# EAGLE design untitled (EAGLE 7.3.0)
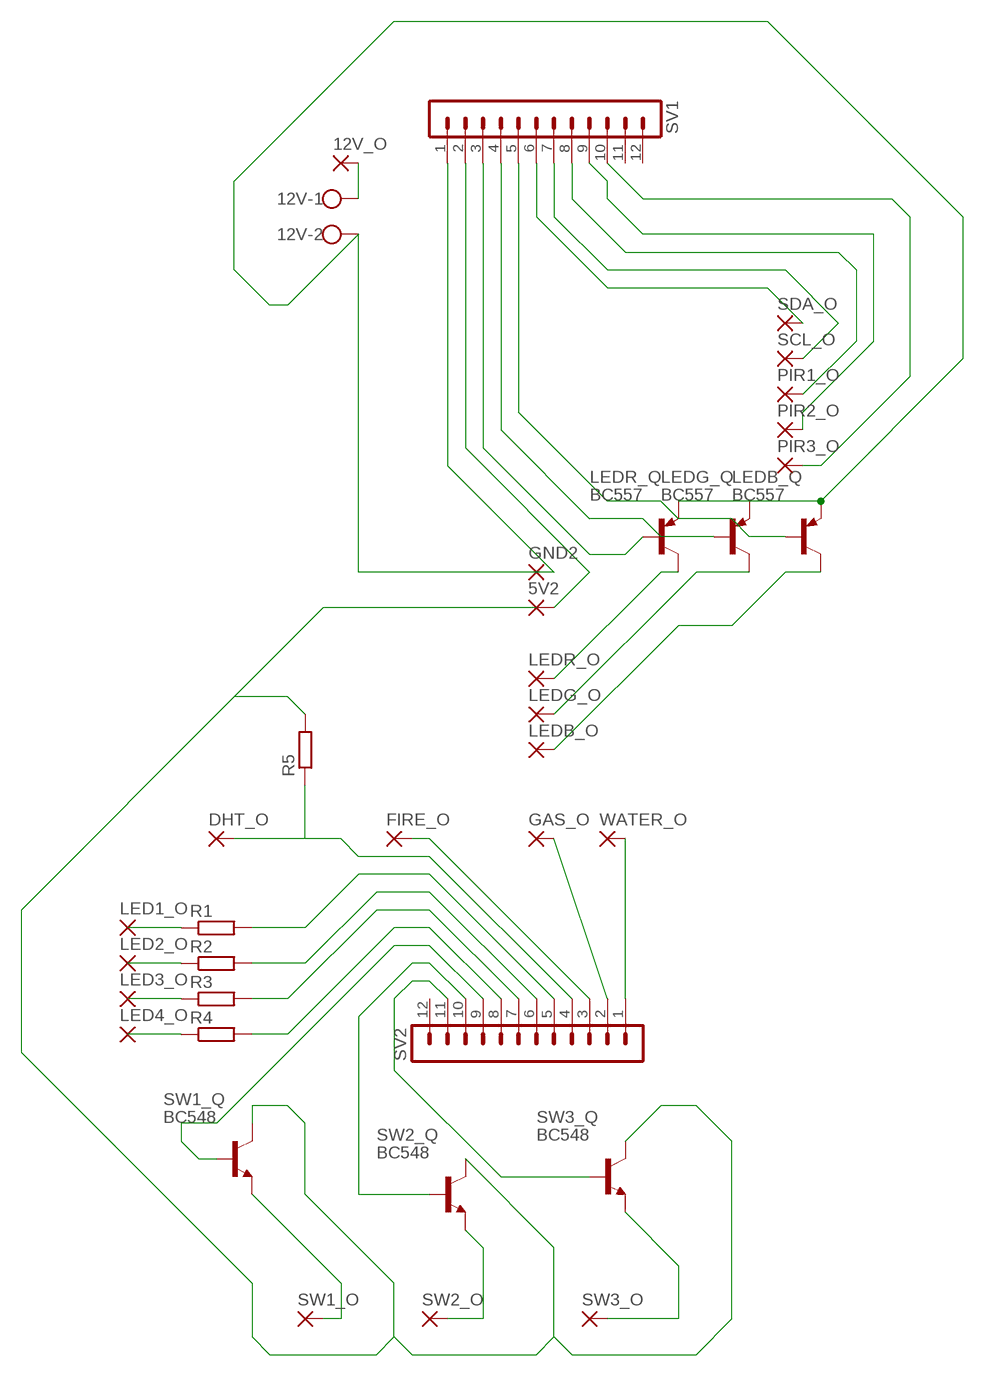
[diagram p0: schematic, sheet 1]

## Parts
5V2  1,6/0,8  [1,6/0,8]
12V  W237-102  [W237-102]
12V_O  1,6/0,8  [1,6/0,8]
DHT_O  1,6/0,8  [1,6/0,8]
FIRE_O  1,6/0,8  [1,6/0,8]
GAS_O  1,6/0,8  [1,6/0,8]
GND2  1,6/0,8  [1,6/0,8]
LED1_O  1,6/0,8  [1,6/0,8]
LED2_O  1,6/0,8  [1,6/0,8]
LED3_O  1,6/0,8  [1,6/0,8]
LED4_O  1,6/0,8  [1,6/0,8]
LEDB_O  1,6/0,8  [1,6/0,8]
LEDB_Q  BC557  [TO92-EBC]
LEDG_O  1,6/0,8  [1,6/0,8]
LEDG_Q  BC557  [TO92-EBC]
LEDR_O  1,6/0,8  [1,6/0,8]
LEDR_Q  BC557  [TO92-EBC]
PIR1_O  1,6/0,8  [1,6/0,8]
PIR2_O  1,6/0,8  [1,6/0,8]
PIR3_O  1,6/0,8  [1,6/0,8]
R1  R-EU_0207/15  [0207/15]
R2  R-EU_0207/15  [0207/15]
R3  R-EU_0207/15  [0207/15]
R4  R-EU_0207/15  [0207/15]
R5  R-EU_0207/15  [0207/15]
SCL_O  1,6/0,8  [1,6/0,8]
SDA_O  1,6/0,8  [1,6/0,8]
SV1  MA12-1W  [MA12-1W]
SV2  MA12-1W  [MA12-1W]
SW1_O  1,6/0,8  [1,6/0,8]
SW1_Q  BC548  [TO92-EBC]
SW2_O  1,6/0,8  [1,6/0,8]
SW2_Q  BC548  [TO92-EBC]
SW3_O  1,6/0,8  [1,6/0,8]
SW3_Q  BC548  [TO92-EBC]
WATER_O  1,6/0,8  [1,6/0,8]

## Nets
N$1: 12V.2 GND2.1(P) LEDB_Q.E LEDG_Q.E LEDR_Q.E SV1.1
N$2: 5V2.1(P) SV1.2
N$3: LEDR_Q.B SV1.3
N$4: LEDG_Q.B SV1.4
N$5: LEDB_Q.B SV1.5
N$6: SDA_O.1(P) SV1.6
N$7: SCL_O.1(P) SV1.7
N$8: PIR1_O.1(P) SV1.8
N$9: PIR2_O.1(P) SV1.9
N$10: PIR3_O.1(P) SV1.10
N$11: SV2.1 WATER_O.1(P)
N$12: GAS_O.1(P) SV2.2
N$13: FIRE_O.1(P) SV2.3
N$14: DHT_O.1(P) R5.1 SV2.4
N$15: SV2.11 SW3_Q.B
N$16: SV2.10 SW2_Q.B
N$17: SV2.9 SW1_Q.B
N$18: R4.2 SV2.8
N$19: R3.2 SV2.7
N$20: R2.2 SV2.6
N$21: R1.2 SV2.5
N$22: LED4_O.1(P) R4.1
N$23: LED3_O.1(P) R3.1
N$24: LED2_O.1(P) R2.1
N$25: LED1_O.1(P) R1.1
N$26: LEDR_O.1(P) LEDR_Q.C
N$27: LEDG_O.1(P) LEDG_Q.C
N$28: R5.2 SW1_Q.C SW2_Q.C SW3_Q.C
N$29: LEDB_O.1(P) LEDB_Q.C
N$30: SW1_O.1(P) SW1_Q.E
N$31: SW2_O.1(P) SW2_Q.E
N$32: SW3_O.1(P) SW3_Q.E
N$33: 12V.1 12V_O.1(P)
Unconnected: SV1.11 SV1.12 SV2.12

## Library data of the parts
5V2 12V_O DHT_O FIRE_O GAS_O GND2 LED1_O LED2_O LED3_O LED4_O LEDB_O LEDG_O LEDR_O PIR1_O PIR2_O PIR3_O SCL_O SDA_O SW1_O SW2_O SW3_O WATER_O = wirepad:1,6/0,8: THROUGH-HOLE PAD
12V = con-wago-500:W237-102: WAGO SCREW CLAMP; MPN: 237-102; OC_FARNELL: unknown; OC_NEWARK: 70K9898
LEDB_Q LEDG_Q LEDR_Q = transistor-pnp:BC557*: PNP Transistror
R1-R5 = resistor:R-EU_: RESISTOR, European symbol
SV1 SV2 = con-lstb:MA12-1W: PIN HEADER; OC_FARNELL: unknown; OC_NEWARK: unknown
SW1_Q SW2_Q SW3_Q = transistor-npn:BC548*: NPN Transistor

## Board
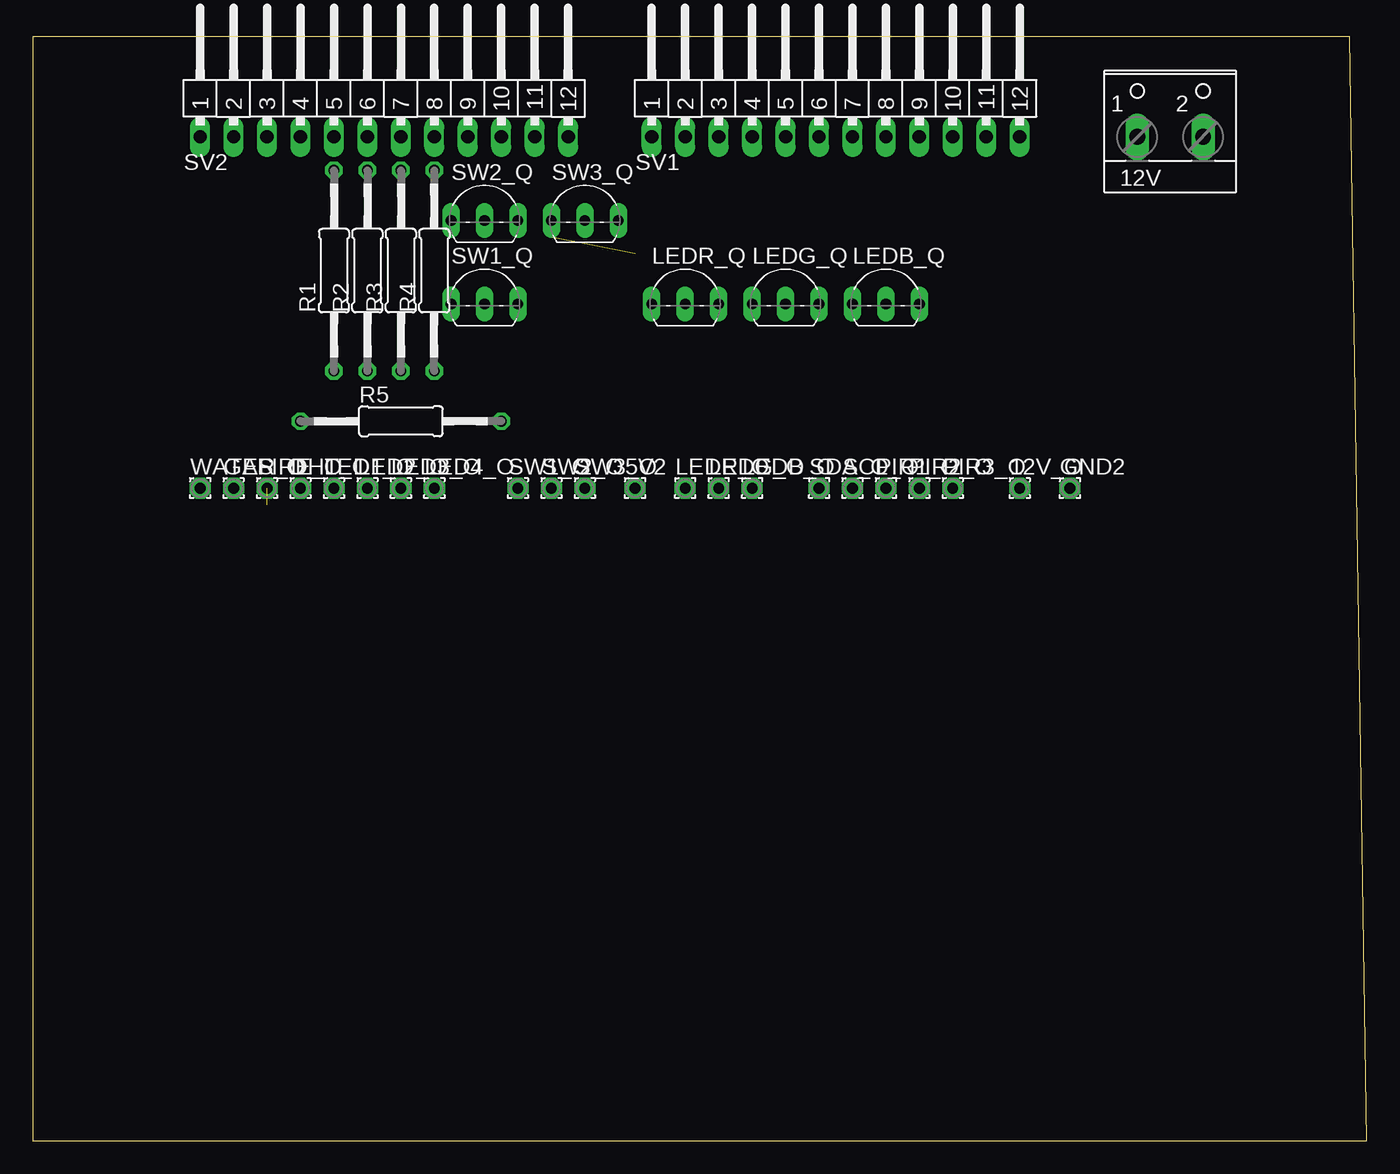
[diagram p1: board, top side]
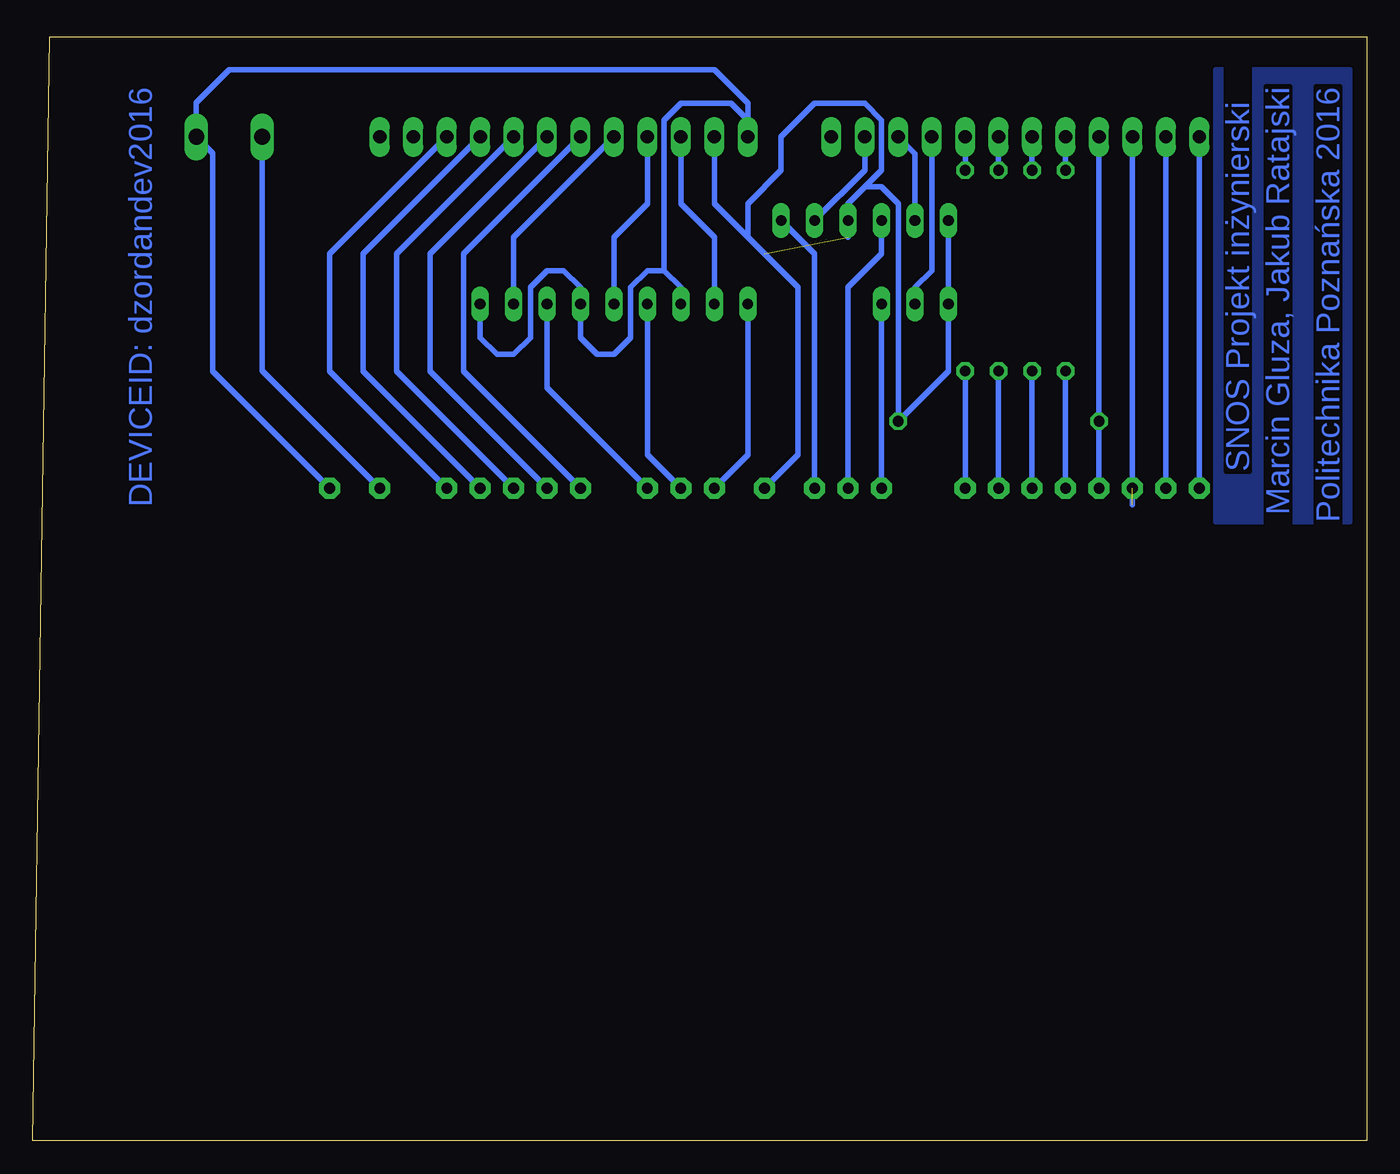
[diagram p2: board, bottom side, seen from below]

Size 101.27 x 83.81 mm. Coordinates in mm from the lower left corner, seen from the top.
Outline: 0,0 101.27,0 100,83.81 0,83.81 0,0
Copper layers (1*16): Top 0.035mm / dielectric 1.5mm / Bottom 0.035mm
Design rules "default": minimum track width 10mil, minimum drill 24mil, track to track 8mil, track to pad 8mil, pad to pad 8mil, via to via 8mil, smd to smd 8mil, copper to edge 40mil, drill to drill 8mil, minimum pad ring 10mil, minimum via ring 8mil, stop-mask expansion 4mil, vias tented up to drill 0mil, thermal gap 10mil

### Footprints (pad centres in the part's own frame; a part is rotated, then mirrored left to right if it is on the bottom)
1,6/0,8 = drill 0.813 pad 1.6 octagon: 1 0,0
W237-102 = drill 1.194 long: 1 -2.5,-1.27; 2 2.5,-1.27
TO92-EBC = drill 0.813 long: B 0,-1.27; C -2.54,-1.27; E 2.54,-1.27
0207/15 = drill 0.813 octagon: 1 -7.62,0; 2 7.62,0
MA12-1W = drill 1.016 long: 1 -13.97,0; 2 -11.43,0; 3 -8.89,0; 4 -6.35,0; 5 -3.81,0; 6 -1.27,0; 7 1.27,0; 8 3.81,0; 9 6.35,0; 10 8.89,0; 11 11.43,0; 12 13.97,0

### Placement (x,y rotation side)
5V2  45.72,49.53 0 top
12V  86.36,77.47 0 top
12V_O  74.93,49.53 0 top
DHT_O  20.32,49.53 0 top
FIRE_O  17.78,49.53 0 top
GAS_O  15.24,49.53 0 top
GND2  78.74,49.53 0 top
LED1_O  22.86,49.53 0 top
LED2_O  25.4,49.53 0 top
LED3_O  27.94,49.53 0 top
LED4_O  30.48,49.53 0 top
LEDB_O  54.61,49.53 0 top
LEDB_Q  64.77,64.77 0 top
LEDG_O  52.07,49.53 0 top
LEDG_Q  57.15,64.77 0 top
LEDR_O  49.53,49.53 0 top
LEDR_Q  49.53,64.77 0 top
PIR1_O  64.77,49.53 0 top
PIR2_O  67.31,49.53 0 top
PIR3_O  69.85,49.53 0 top
R1  22.86,66.04 90 top
R2  25.4,66.04 90 top
R3  27.94,66.04 90 top
R4  30.48,66.04 90 top
R5  27.94,54.61 0 top
SCL_O  62.23,49.53 0 top
SDA_O  59.69,49.53 0 top
SV1  60.96,76.2 0 top
SV2  26.67,76.2 0 top
SW1_O  36.83,49.53 0 top
SW1_Q  34.29,64.77 0 top
SW2_O  39.37,49.53 0 top
SW2_Q  34.29,71.12 0 top
SW3_O  41.91,49.53 0 top
SW3_Q  41.91,71.12 0 top
WATER_O  12.7,49.53 0 top

### Tracks (layer width: path | path; a pad name or v marks a point on that pad's centre or on a via)
N$1
  Bottom 0.406: GND2.1 87.63,58.42 87.63,74.97 12V.2 88.86,78.78 86.36,81.28 49.53,81.28 46.99,78.74 SV1.1 46.99,77.47 48.26,78.74 52.07,78.74 53.34,77.47 53.34,66.04 | LEDB_Q.E 67.31,60.96 66.04,59.69 64.77,59.69 63.5,60.96 63.5,64.77 62.23,66.04 60.96,66.04 59.69,64.77 LEDG_Q.E 59.69,60.96 58.42,59.69 57.15,59.69 55.88,60.96 55.88,64.77 54.61,66.04 53.34,66.04 | 53.34,66.04 52.07,64.77 LEDR_Q.E
N$2
  Bottom 0.406: 5V2.1 43.18,52.07 43.18,64.77 49.53,71.12 SV1.2
N$3
  Bottom 0.406: LEDR_Q.B 49.53,68.58 52.07,71.12 SV1.3
N$4
  Bottom 0.406: LEDG_Q.B 57.15,68.58 54.61,71.12 SV1.4
N$5
  Bottom 0.406: LEDB_Q.B 64.77,68.58 SV1.5
N$6
  Bottom 0.406: SDA_O.1 68.58,58.42 68.58,67.31 SV1.6
N$7
  Bottom 0.406: SV1.7 71.12,67.31 71.12,58.42 SCL_O.1
N$8
  Bottom 0.406: PIR1_O.1 73.66,58.42 73.66,67.31 SV1.8
N$9
  Bottom 0.406: PIR2_O.1 76.2,58.42 76.2,67.31 SV1.9
N$10
  Bottom 0.406: PIR3_O.1 78.74,58.42 78.74,67.31 SV1.10
N$11
  Bottom 0.406: SV2.1 WATER_O.1
N$12
  Bottom 0.406: SV2.2 GAS_O.1
N$13  (1 unrouted)
  Bottom 0.406: SV2.3 17.78,48.26
N$14
  Bottom 0.406: SV2.4 R5.1 DHT_O.1
N$15
  Bottom 0.406: SW3_Q.B 38.1,73.66 SV2.11
N$16
  Bottom 0.406: SV2.10 34.29,74.93 SW2_Q.B
N$17
  Bottom 0.406: SV2.9 33.02,66.04 34.29,64.77 SW1_Q.B
N$18
  Bottom 0.406: SV2.8 R4.2
N$19
  Bottom 0.406: SV2.7 R3.2
N$20
  Bottom 0.406: SV2.6 R2.2
N$21
  Bottom 0.406: SV2.5 R1.2
N$22
  Bottom 0.406: R4.1 LED4_O.1
N$23
  Bottom 0.406: R3.1 LED3_O.1
N$24
  Bottom 0.406: R2.1 LED2_O.1
N$25
  Bottom 0.406: R1.1 LED1_O.1
N$26
  Bottom 0.406: LEDR_O.1 46.99,52.07 LEDR_Q.C
N$27
  Bottom 0.406: LEDG_O.1 54.61,52.07 LEDG_Q.C
N$28  (1 unrouted)
  Bottom 0.406: SW2_Q.C SW1_Q.C 31.75,58.42 R5.2 35.56,71.12 36.83,72.39 38.1,72.39 | 38.1,72.39 39.37,71.12 SW3_Q.C 39.37,68.58 | 38.1,72.39 36.83,73.66 36.83,77.47 38.1,78.74 41.91,78.74 44.45,76.2 44.45,73.66 46.99,71.12 46.99,68.58 45.72,67.31
N$29
  Bottom 0.406: LEDB_O.1 62.23,57.15 LEDB_Q.C
N$30
  Bottom 0.406: SW1_Q.E SW1_O.1
N$31
  Bottom 0.406: SW2_O.1 39.37,64.77 36.83,67.31 SW2_Q.E
N$32
  Bottom 0.406: SW3_Q.E 41.91,67.31 SW3_O.1
N$33
  Bottom 0.406: 12V.1 83.86,58.46 12V_O.1
N$34
  pour Bottom: 1.27,81.28 11.43,81.28 11.43,66.04 11.43,46.99 1.27,46.99

### Text on the board
Bottom: Politechnika Poznańska 2016 | Marcin Gluza, Jakub Ratajski | DEVICEID: dzordandev2016 | SNOS Projekt inżynierski